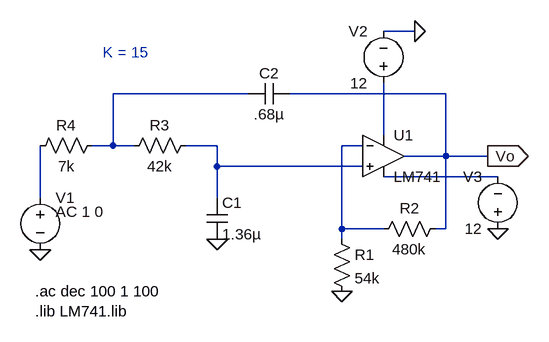
[diagram p0: schematic q6.asc]
q6.asc, the LTspice schematic file:
Version 4
SHEET 1 880 680
WIRE 688 48 640 48
WIRE 432 144 224 144
WIRE 736 144 496 144
WIRE 640 208 640 128
WIRE 224 224 224 144
WIRE 224 224 192 224
WIRE 256 224 224 224
WIRE 384 224 336 224
WIRE 608 224 576 224
WIRE 736 240 736 144
WIRE 736 240 672 240
WIRE 800 240 736 240
WIRE 384 256 384 224
WIRE 608 256 384 256
WIRE 816 272 640 272
WIRE 112 304 112 224
WIRE 384 304 384 256
WIRE 576 352 576 224
WIRE 640 352 576 352
WIRE 736 352 736 240
WIRE 736 352 720 352
WIRE 576 368 576 352
FLAG 800 240 Vo
IOPIN 800 240 Out
FLAG 576 448 0
FLAG 384 368 0
FLAG 112 384 0
FLAG 816 352 0
FLAG 688 48 0
SYMBOL res 560 352 R0
SYMATTR InstName R1
SYMATTR Value 54k
SYMBOL res 736 336 R90
WINDOW 0 0 56 VBottom 2
WINDOW 3 32 56 VTop 2
SYMATTR InstName R2
SYMATTR Value 480k
SYMBOL res 352 208 R90
WINDOW 0 0 56 VBottom 2
WINDOW 3 32 56 VTop 2
SYMATTR InstName R3
SYMATTR Value 42k
SYMBOL res 208 208 R90
WINDOW 0 0 56 VBottom 2
WINDOW 3 32 56 VTop 2
SYMATTR InstName R4
SYMATTR Value 7k
SYMBOL cap 368 304 R0
SYMATTR InstName C1
SYMATTR Value 1.36µ
SYMBOL cap 496 128 R90
WINDOW 0 0 32 VBottom 2
WINDOW 3 32 32 VTop 2
SYMATTR InstName C2
SYMATTR Value .68µ
SYMBOL voltage 112 288 R0
WINDOW 123 24 38 Left 2
SYMATTR Value2 AC 1 0
SYMATTR InstName V1
SYMATTR Value ""
SYMBOL LM741 640 176 R0
SYMATTR InstName U1
SYMBOL voltage 640 144 R180
WINDOW 0 24 96 Left 2
WINDOW 3 24 16 Left 2
SYMATTR InstName V2
SYMATTR Value 12
SYMBOL voltage 816 368 R180
WINDOW 0 24 96 Left 2
WINDOW 3 24 16 Left 2
SYMATTR InstName V3
SYMATTR Value 12
TEXT 104 448 Left 2 !.ac dec 100 1 100\n.lib LM741.lib
TEXT 208 80 Left 2 ;K = 15

The netlist it stands for:
* q6.asc
R1 N004 0 54k
R2 Vo N004 480k
R3 N003 N001 42k
R4 N001 N006 7k
C1 N003 0 1.36µ
C2 Vo N001 .68µ
V1 N006 0 AC 1 0
XU1 N003 N004 N002 N005 Vo LM741  ; pins In+ In- V+ V- OUT
V2 N002 0 12
V3 0 N005 12
.ac dec 100 1 100
.lib LM741.lib
* K = 15
.lib LM741.lib
.backanno
.end